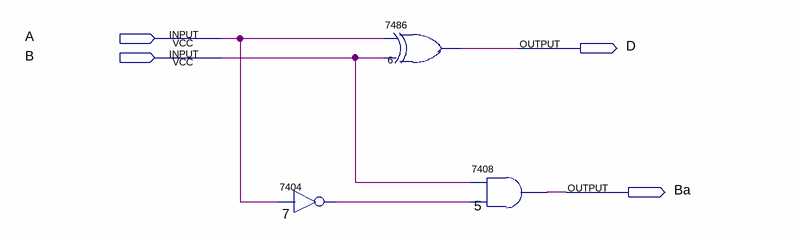
[diagram p0: schematic sheet]
// Quartus schematic Project.bdf as structural Verilog: 3 symbols, 4 pins
module Project (
  input  A,
  input  B,
  output D,
  output Ba
);

  wire n7_1;

  \7404  u_7 (.\2 (A), .\1 (n7_1));
  \7486  u_6 (.\2 (A), .\3 (B), .\1 (D));
  \7408  u_5 (.\3 (n7_1), .\2 (B), .\1 (Ba));
endmodule
